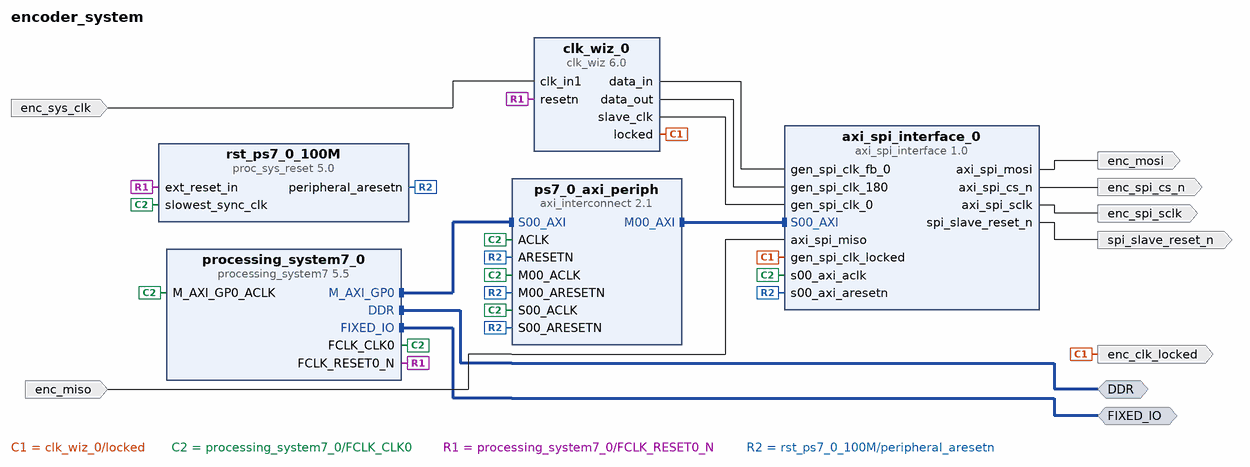
[diagram p0: block diagram of the top level]
# Vivado block design encoder_system, xc7z020clg484-1, Vivado 2022.1
create_bd_design encoder_system

create_bd_intf_port -mode Master -vlnv xilinx.com:interface:ddrx_rtl:1.0 DDR
create_bd_intf_port -mode Master -vlnv xilinx.com:display_processing_system7:fixedio_rtl:1.0 FIXED_IO
create_bd_port -dir I -type clk enc_sys_clk
set_property -dict {CONFIG.FREQ_HZ 100000000} [get_bd_ports enc_sys_clk]
create_bd_port -dir O -type data enc_clk_locked
create_bd_port -dir I -type data enc_miso
create_bd_port -dir O -type data enc_mosi
create_bd_port -dir O -type clk enc_spi_sclk
create_bd_port -dir O -type data enc_spi_cs_n
create_bd_port -dir O -type data spi_slave_reset_n

create_bd_cell -type ip -vlnv xilinx.com:ip:processing_system7:5.5 processing_system7_0
set_property -dict [list \
  CONFIG.PCW_APU_PERIPHERAL_FREQMHZ 666.666667 \
  CONFIG.PCW_ENET0_ENET0_IO {MIO 16 .. 27} \
  CONFIG.PCW_ENET0_GRP_MDIO_ENABLE 1 \
  CONFIG.PCW_ENET0_GRP_MDIO_IO {MIO 52 .. 53} \
  CONFIG.PCW_ENET0_PERIPHERAL_ENABLE 1 \
  CONFIG.PCW_ENET0_RESET_ENABLE 0 \
  CONFIG.PCW_ENET_RESET_ENABLE 1 \
  CONFIG.PCW_ENET_RESET_SELECT {Share reset pin} \
  CONFIG.PCW_FPGA0_PERIPHERAL_FREQMHZ 100.000000 \
  CONFIG.PCW_FPGA1_PERIPHERAL_FREQMHZ 150.000000 \
  CONFIG.PCW_FPGA2_PERIPHERAL_FREQMHZ 50.000000 \
  CONFIG.PCW_GPIO_MIO_GPIO_ENABLE 1 \
  CONFIG.PCW_GPIO_MIO_GPIO_IO MIO \
  CONFIG.PCW_I2C_RESET_ENABLE 1 \
  CONFIG.PCW_PRESET_BANK1_VOLTAGE {LVCMOS 1.8V} \
  CONFIG.PCW_QSPI_GRP_SINGLE_SS_ENABLE 1 \
  CONFIG.PCW_QSPI_GRP_SINGLE_SS_IO {MIO 1 .. 6} \
  CONFIG.PCW_QSPI_PERIPHERAL_ENABLE 1 \
  CONFIG.PCW_QSPI_PERIPHERAL_FREQMHZ 200.000000 \
  CONFIG.PCW_QSPI_QSPI_IO {MIO 1 .. 6} \
  CONFIG.PCW_SD0_GRP_CD_ENABLE 1 \
  CONFIG.PCW_SD0_GRP_CD_IO {MIO 47} \
  CONFIG.PCW_SD0_GRP_WP_ENABLE 1 \
  CONFIG.PCW_SD0_GRP_WP_IO {MIO 46} \
  CONFIG.PCW_SD0_PERIPHERAL_ENABLE 1 \
  CONFIG.PCW_SD0_SD0_IO {MIO 40 .. 45} \
  CONFIG.PCW_SDIO_PERIPHERAL_FREQMHZ 50 \
  CONFIG.PCW_SINGLE_QSPI_DATA_MODE x4 \
  CONFIG.PCW_TTC0_PERIPHERAL_ENABLE 1 \
  CONFIG.PCW_TTC0_TTC0_IO EMIO \
  CONFIG.PCW_UART1_PERIPHERAL_ENABLE 1 \
  CONFIG.PCW_UART1_UART1_IO {MIO 48 .. 49} \
  CONFIG.PCW_UART_PERIPHERAL_FREQMHZ 50 \
  CONFIG.PCW_UIPARAM_DDR_FREQ_MHZ 533.333313 \
  CONFIG.PCW_UIPARAM_DDR_PARTNO {MT41J128M16 HA-15E} \
  CONFIG.PCW_USB0_PERIPHERAL_ENABLE 1 \
  CONFIG.PCW_USB0_RESET_ENABLE 0 \
  CONFIG.PCW_USB0_USB0_IO {MIO 28 .. 39} \
  CONFIG.PCW_USB_RESET_ENABLE 1 \
  CONFIG.PCW_USB_RESET_SELECT {Share reset pin} \
  CONFIG.preset ZedBoard \
] [get_bd_cells processing_system7_0]
# 221 more settings of processing_system7_0 are not shown: defaults, MIO pin electricals, DDR timing, and values the tool derives
create_bd_cell -type ip -vlnv xilinx.com:user:axi_spi_interface:1.0 axi_spi_interface_0
set_property -dict [list \
  CONFIG.SPI_CLK_FB_DELAY_WIDTH 4 \
  CONFIG.SPI_DUMMY_BITS_BEG 1 \
  CONFIG.SPI_DUMMY_BITS_END 1 \
  CONFIG.SPI_INIT_INTERVAL 1 \
] [get_bd_cells axi_spi_interface_0]
create_bd_cell -type ip -vlnv xilinx.com:ip:clk_wiz:6.0 clk_wiz_0
set_property -dict [list \
  CONFIG.CLKOUT1_JITTER 174.188 \
  CONFIG.CLKOUT1_PHASE_ERROR 99.281 \
  CONFIG.CLKOUT1_REQUESTED_OUT_FREQ 25.000 \
  CONFIG.CLKOUT1_REQUESTED_PHASE 180.000 \
  CONFIG.CLKOUT2_JITTER 174.188 \
  CONFIG.CLKOUT2_PHASE_ERROR 99.281 \
  CONFIG.CLKOUT2_REQUESTED_OUT_FREQ 25.000 \
  CONFIG.CLKOUT2_USED true \
  CONFIG.CLKOUT3_JITTER 174.188 \
  CONFIG.CLKOUT3_PHASE_ERROR 99.281 \
  CONFIG.CLKOUT3_REQUESTED_OUT_FREQ 25.000 \
  CONFIG.CLKOUT3_REQUESTED_PHASE 210.000 \
  CONFIG.CLKOUT3_USED true \
  CONFIG.CLK_IN1_BOARD_INTERFACE sys_clock \
  CONFIG.CLK_OUT1_PORT slave_clk \
  CONFIG.CLK_OUT2_PORT data_out \
  CONFIG.CLK_OUT3_PORT data_in \
  CONFIG.MMCM_CLKFBOUT_MULT_F 9.750 \
  CONFIG.MMCM_CLKOUT0_DIVIDE_F 39.000 \
  CONFIG.MMCM_CLKOUT0_PHASE 180.000 \
  CONFIG.MMCM_CLKOUT1_DIVIDE 39 \
  CONFIG.MMCM_CLKOUT2_DIVIDE 39 \
  CONFIG.MMCM_CLKOUT2_PHASE 210.000 \
  CONFIG.NUM_OUT_CLKS 3 \
  CONFIG.RESET_PORT resetn \
  CONFIG.RESET_TYPE ACTIVE_LOW \
  CONFIG.USE_BOARD_FLOW true \
] [get_bd_cells clk_wiz_0]
create_bd_cell -type ip -vlnv xilinx.com:ip:axi_interconnect:2.1 ps7_0_axi_periph
set_property -dict {CONFIG.NUM_MI 1} [get_bd_cells ps7_0_axi_periph]
create_bd_cell -type ip -vlnv xilinx.com:ip:proc_sys_reset:5.0 rst_ps7_0_100M

# ---- connections ----

connect_bd_intf_net [get_bd_intf_ports DDR] [get_bd_intf_pins processing_system7_0/DDR]
connect_bd_intf_net [get_bd_intf_ports FIXED_IO] [get_bd_intf_pins processing_system7_0/FIXED_IO]
connect_bd_intf_net [get_bd_intf_pins processing_system7_0/M_AXI_GP0] [get_bd_intf_pins ps7_0_axi_periph/S00_AXI]
connect_bd_intf_net [get_bd_intf_pins ps7_0_axi_periph/M00_AXI] [get_bd_intf_pins axi_spi_interface_0/S00_AXI]
connect_bd_net [get_bd_pins axi_spi_interface_0/axi_spi_cs_n] [get_bd_ports enc_spi_cs_n]
connect_bd_net [get_bd_pins axi_spi_interface_0/axi_spi_mosi] [get_bd_ports enc_mosi]
connect_bd_net [get_bd_pins axi_spi_interface_0/axi_spi_sclk] [get_bd_ports enc_spi_sclk]
connect_bd_net [get_bd_pins axi_spi_interface_0/spi_slave_reset_n] [get_bd_ports spi_slave_reset_n]
connect_bd_net [get_bd_pins clk_wiz_0/data_in] [get_bd_pins axi_spi_interface_0/gen_spi_clk_fb_0]
connect_bd_net [get_bd_pins clk_wiz_0/data_out] [get_bd_pins axi_spi_interface_0/gen_spi_clk_180]
connect_bd_net [get_bd_pins clk_wiz_0/locked] [get_bd_ports enc_clk_locked] [get_bd_pins axi_spi_interface_0/gen_spi_clk_locked]
connect_bd_net [get_bd_pins clk_wiz_0/slave_clk] [get_bd_pins axi_spi_interface_0/gen_spi_clk_0]
connect_bd_net [get_bd_ports enc_miso] [get_bd_pins axi_spi_interface_0/axi_spi_miso]
connect_bd_net [get_bd_ports enc_sys_clk] [get_bd_pins clk_wiz_0/clk_in1]
connect_bd_net [get_bd_pins processing_system7_0/FCLK_CLK0] \
  [get_bd_pins processing_system7_0/M_AXI_GP0_ACLK] [get_bd_pins ps7_0_axi_periph/S00_ACLK] \
  [get_bd_pins rst_ps7_0_100M/slowest_sync_clk] [get_bd_pins axi_spi_interface_0/s00_axi_aclk] \
  [get_bd_pins ps7_0_axi_periph/M00_ACLK] [get_bd_pins ps7_0_axi_periph/ACLK]
connect_bd_net [get_bd_pins processing_system7_0/FCLK_RESET0_N] [get_bd_pins rst_ps7_0_100M/ext_reset_in] [get_bd_pins clk_wiz_0/resetn]
connect_bd_net [get_bd_pins rst_ps7_0_100M/peripheral_aresetn] \
  [get_bd_pins ps7_0_axi_periph/S00_ARESETN] [get_bd_pins axi_spi_interface_0/s00_axi_aresetn] \
  [get_bd_pins ps7_0_axi_periph/M00_ARESETN] [get_bd_pins ps7_0_axi_periph/ARESETN]

# ---- address map ----
assign_bd_address -offset 0x43C00000 -range 64K -target_address_space [get_bd_addr_spaces processing_system7_0/Data] [get_bd_addr_segs axi_spi_interface_0/S00_AXI/S00_AXI_reg]

validate_bd_design
save_bd_design
